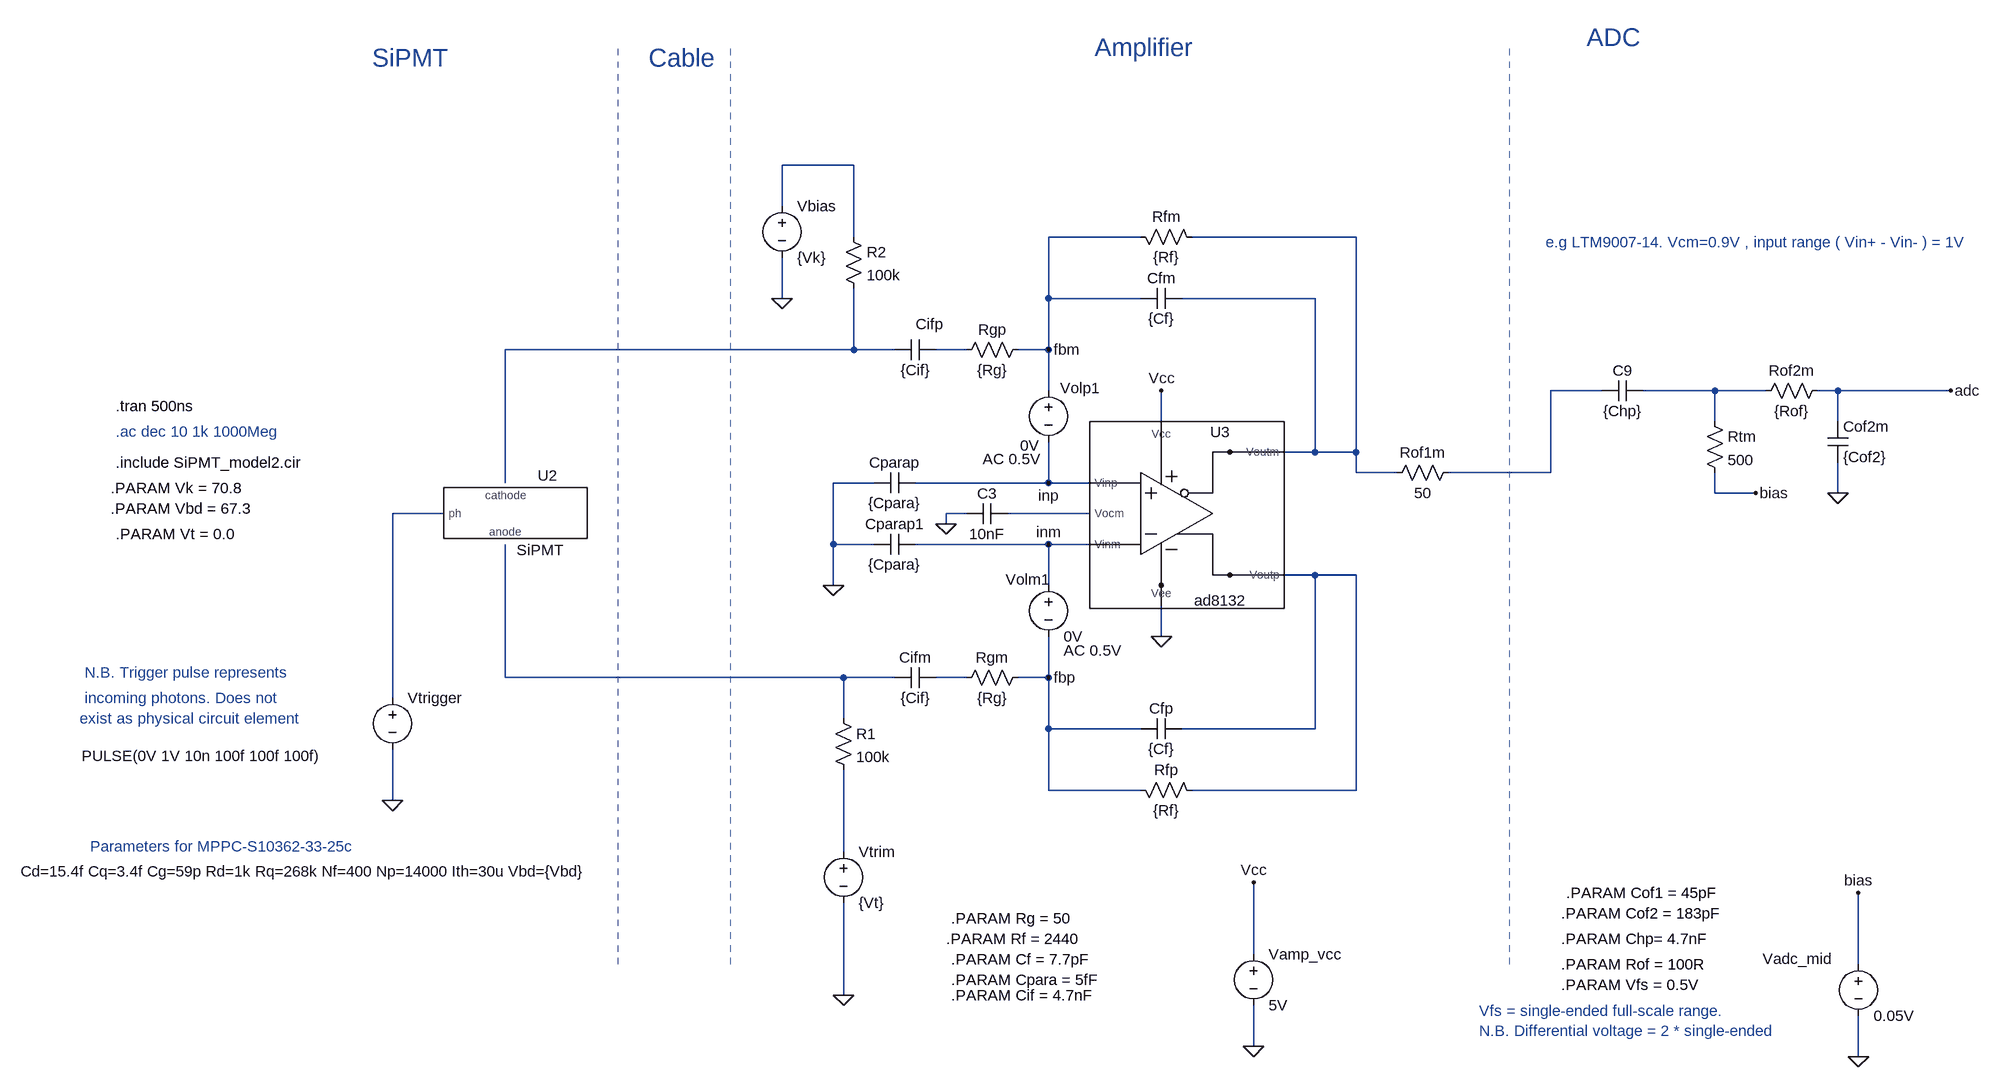
[diagram p0: schematic SiPMT_test_mppc33_ad81322_v8_unipolar_open_loop.asc]
SiPMT_test_mppc33_ad81322_v8_unipolar_open_loop.asc, the LTspice schematic file:
Version 4
SHEET 1 3296 1892
WIRE 1456 64 1344 64
WIRE 1344 128 1344 64
WIRE 1456 176 1456 64
WIRE 1904 176 1760 176
WIRE 2240 176 1984 176
WIRE 1344 272 1344 208
WIRE 1760 272 1760 176
WIRE 1904 272 1760 272
WIRE 2176 272 1968 272
WIRE 1456 352 1456 256
WIRE 1456 352 912 352
WIRE 1520 352 1456 352
WIRE 1632 352 1584 352
WIRE 1760 352 1760 272
WIRE 1760 352 1712 352
WIRE 1760 416 1760 352
WIRE 2624 416 2544 416
WIRE 2800 416 2688 416
WIRE 2880 416 2800 416
WIRE 2992 416 2960 416
WIRE 3168 416 2992 416
WIRE 1936 464 1936 416
WIRE 2800 464 2800 416
WIRE 2992 464 2992 416
WIRE 2176 512 2176 272
WIRE 2176 512 2128 512
WIRE 2240 512 2240 176
WIRE 2240 512 2176 512
WIRE 2240 544 2240 512
WIRE 2304 544 2240 544
WIRE 2544 544 2544 416
WIRE 2544 544 2384 544
WIRE 912 560 912 352
WIRE 1488 560 1424 560
WIRE 1760 560 1760 496
WIRE 1760 560 1552 560
WIRE 1824 560 1760 560
WIRE 2800 576 2800 544
WIRE 2864 576 2800 576
WIRE 2992 576 2992 528
WIRE 816 608 736 608
WIRE 1632 608 1600 608
WIRE 1824 608 1696 608
WIRE 1600 624 1600 608
WIRE 1424 656 1424 560
WIRE 1488 656 1424 656
WIRE 1760 656 1552 656
WIRE 1824 656 1760 656
WIRE 2176 704 2128 704
WIRE 2240 704 2176 704
WIRE 1424 720 1424 656
WIRE 1760 720 1760 656
WIRE 1936 800 1936 752
WIRE 912 864 912 656
WIRE 1440 864 912 864
WIRE 1520 864 1440 864
WIRE 1632 864 1584 864
WIRE 1760 864 1760 800
WIRE 1760 864 1712 864
WIRE 736 896 736 608
WIRE 1440 928 1440 864
WIRE 1760 944 1760 864
WIRE 1904 944 1760 944
WIRE 2176 944 2176 704
WIRE 2176 944 1968 944
WIRE 1760 1040 1760 944
WIRE 1904 1040 1760 1040
WIRE 2240 1040 2240 704
WIRE 2240 1040 1984 1040
WIRE 736 1056 736 976
WIRE 1440 1136 1440 1008
WIRE 2080 1296 2080 1184
WIRE 3024 1312 3024 1200
WIRE 1440 1360 1440 1216
WIRE 2080 1440 2080 1376
WIRE 3024 1456 3024 1392
FLAG 1344 272 0
FLAG 1440 1360 0
FLAG 736 1056 0
FLAG 1936 416 Vcc
FLAG 1936 800 0
FLAG 2080 1440 0
FLAG 2080 1184 Vcc
FLAG 1600 624 0
FLAG 3168 416 adc
FLAG 3024 1456 0
FLAG 3024 1200 bias
FLAG 2864 576 bias
FLAG 2992 576 0
FLAG 1760 352 fbm
FLAG 1760 560 inp
FLAG 1760 656 inm
FLAG 1760 864 fbp
FLAG 1424 720 0
SYMBOL voltage 1344 112 R0
SYMATTR InstName Vbias
SYMATTR Value {Vk}
SYMBOL res 1424 912 R0
SYMATTR InstName R1
SYMATTR Value 100k
SYMBOL voltage 736 880 R0
WINDOW 3 -485 106 Left 2
SYMATTR Value PULSE(0V 1V 10n 100f 100f 100f)
SYMATTR InstName Vtrigger
SYMBOL res 1440 160 R0
SYMATTR InstName R2
SYMATTR Value 100k
SYMBOL cap 1520 336 M90
WINDOW 0 -8 54 VBottom 2
WINDOW 3 32 32 VTop 2
SYMATTR InstName Cifp
SYMATTR Value {Cif}
SYMBOL cap 1520 848 M90
WINDOW 0 0 32 VBottom 2
WINDOW 3 32 32 VTop 2
SYMATTR InstName Cifm
SYMATTR Value {Cif}
SYMBOL res 1728 336 R90
WINDOW 0 0 56 VBottom 2
WINDOW 3 32 56 VTop 2
SYMATTR InstName Rgp
SYMATTR Value {Rg}
SYMBOL res 1728 848 R90
WINDOW 0 0 56 VBottom 2
WINDOW 3 32 56 VTop 2
SYMATTR InstName Rgm
SYMATTR Value {Rg}
SYMBOL voltage 2080 1280 R0
WINDOW 123 0 0 Left 2
WINDOW 39 0 0 Left 2
SYMATTR InstName Vamp_vcc
SYMATTR Value 5V
SYMBOL cap 1696 592 R90
WINDOW 0 0 32 VBottom 2
WINDOW 3 32 32 VTop 2
SYMATTR InstName C3
SYMATTR Value 10nF
SYMBOL res 1888 160 M90
WINDOW 0 0 56 VBottom 2
WINDOW 3 32 56 VTop 2
SYMATTR InstName Rfm
SYMATTR Value {Rf}
SYMBOL cap 1968 256 R90
WINDOW 0 0 32 VBottom 2
WINDOW 3 32 32 VTop 2
SYMATTR InstName Cfm
SYMATTR Value {Cf}
SYMBOL res 1888 1024 M90
WINDOW 0 0 56 VBottom 2
WINDOW 3 32 56 VTop 2
SYMATTR InstName Rfp
SYMATTR Value {Rf}
SYMBOL cap 1968 928 R90
WINDOW 0 0 32 VBottom 2
WINDOW 3 32 32 VTop 2
SYMATTR InstName Cfp
SYMATTR Value {Cf}
SYMBOL cap 2688 400 R90
WINDOW 0 0 32 VBottom 2
WINDOW 3 32 32 VTop 2
SYMATTR InstName C9
SYMATTR Value {Chp}
SYMBOL res 2784 448 R0
SYMATTR InstName Rtm
SYMATTR Value 500
SYMBOL res 2976 400 R90
WINDOW 0 0 56 VBottom 2
WINDOW 3 32 56 VTop 2
SYMATTR InstName Rof2m
SYMATTR Value {Rof}
SYMBOL cap 2976 464 R0
SYMATTR InstName Cof2m
SYMATTR Value {Cof2}
SYMBOL voltage 3024 1296 R0
WINDOW 123 0 0 Left 2
WINDOW 39 0 0 Left 2
WINDOW 0 -149 7 Left 2
SYMATTR InstName Vadc_mid
SYMATTR Value 0.05V
SYMBOL voltage 1440 1120 R0
SYMATTR InstName Vtrim
SYMATTR Value {Vt}
SYMBOL SiPMT 912 608 R0
WINDOW 39 -316 543 Top 2
SYMATTR SpiceLine Cd=15.4f Cq=3.4f Cg=59p Rd=1k Rq=268k Nf=400 Np=14000 Ith=30u Vbd={Vbd}
SYMATTR InstName U2
SYMBOL cap 1552 544 R90
WINDOW 0 0 32 VBottom 2
WINDOW 3 32 32 VTop 2
SYMATTR InstName Cparap
SYMATTR Value {Cpara}
SYMBOL cap 1552 640 R90
WINDOW 0 0 32 VBottom 2
WINDOW 3 32 32 VTop 2
SYMATTR InstName Cparap1
SYMATTR Value {Cpara}
SYMBOL res 2400 528 R90
WINDOW 0 0 56 VBottom 2
WINDOW 3 32 56 VTop 2
SYMATTR InstName Rof1m
SYMATTR Value 50
SYMBOL ad8132 1952 608 R0
SYMATTR InstName U3
SYMBOL voltage 1760 400 R0
WINDOW 0 18 12 Left 2
WINDOW 3 -44 102 Left 2
WINDOW 123 -103 123 Left 2
SYMATTR InstName Volp1
SYMATTR Value 0V
SYMATTR Value2 AC 0.5V
SYMBOL voltage 1760 704 R0
WINDOW 0 -67 7 Left 2
WINDOW 123 24 118 Left 2
SYMATTR InstName Volm1
SYMATTR Value2 AC 0.5V
SYMATTR Value 0V
TEXT 304 480 Left 2 ;.ac dec 10 1k 1000Meg
TEXT 304 528 Left 2 !.include SiPMT_model2.cir
TEXT 296 568 Left 2 !.PARAM Vk = 70.8
TEXT 296 600 Left 2 !.PARAM Vbd = 67.3
TEXT 264 1128 Left 2 ;Parameters for MPPC-S10362-33-25c
TEXT 1608 1240 Left 2 !.PARAM Rg = 50
TEXT 1600 1272 Left 2 !.PARAM Rf = 2440
TEXT 1608 1304 Left 2 !.PARAM Cf = 7.7pF
TEXT 2560 1232 Left 2 !.PARAM Cof2 = 183pF
TEXT 2560 1272 Left 2 !.PARAM Chp= 4.7nF
TEXT 2560 1312 Left 2 !.PARAM Rof = 100R
TEXT 1832 -120 Left 4 ;Amplifier
TEXT 2600 -136 Left 4 ;ADC
TEXT 704 -104 Left 4 ;SiPMT
TEXT 256 856 Left 2 ;N.B. Trigger pulse represents
TEXT 256 896 Left 2 ;incoming photons. Does not
TEXT 248 928 Left 2 ;exist as physical circuit element
TEXT 2536 184 Left 2 ;e.g LTM9007-14. Vcm=0.9V , input range ( Vin+ - Vin- ) = 1V
TEXT 304 640 Left 2 !.PARAM Vt = 0.0
TEXT 1136 -104 Left 4 ;Cable
TEXT 1608 1336 Left 2 !.PARAM Cpara = 5fF
TEXT 304 440 Left 2 !.tran 500ns
TEXT 1608 1360 Left 2 !.PARAM Cif = 4.7nF
TEXT 2560 1344 Left 2 !.PARAM Vfs = 0.5V
TEXT 2432 1384 Left 2 ;Vfs = single-ended full-scale range. \nN.B. Differential voltage = 2 * single-ended
TEXT 2568 1200 Left 2 !.PARAM Cof1 = 45pF
LINE Normal 2480 1312 2480 -128 2
LINE Normal 1264 1312 1264 -128 2
LINE Normal 1088 1312 1088 -128 2

The netlist it stands for:
* SiPMT_test_mppc33_ad81322_v8_unipolar_open_loop.asc
Vbias N001 0 {Vk}
R1 N010 N012 100k
Vtrigger N007 0 PULSE(0V 1V 10n 100f 100f 100f)
R2 N001 N003 100k
Cifp N003 N004 {Cif}
Cifm N010 N011 {Cif}
Rgp fbm N004 {Rg}
Rgm fbp N011 {Rg}
Vamp_vcc Vcc 0 5V
C3 N008 0 10nF
Rfm fbm N002 {Rf}
Cfm N002 fbm {Cf}
Rfp fbp N009 {Rf}
Cfp N009 fbp {Cf}
C9 N006 N005 {Chp}
Rtm N006 bias 500
Rof2m adc N006 {Rof}
Cof2m adc 0 {Cof2}
Vadc_mid bias 0 0.05V
Vtrim N012 0 {Vt}
XU2 N010 N003 N007 SiPMT Cd=15.4f Cq=3.4f Cg=59p Rd=1k Rq=268k Nf=400 Np=14000 Ith=30u Vbd={Vbd}  ; pins anode cathode ph
Cparap inp 0 {Cpara}
Cparap1 inm 0 {Cpara}
Rof1m N005 N002 50
XU3 inp inm Vcc 0 N002 N009 N008 ad8132  ; pins Vinp Vinm Vcc Vee Voutm Voutp Vocm
Volp1 fbm inp 0V AC 0.5V
Volm1 inm fbp 0V AC 0.5V
* .ac dec 10 1k 1000Meg
.include SiPMT_model2.cir
.PARAM Vk = 70.8
.PARAM Vbd = 67.3
* Parameters for MPPC-S10362-33-25c
.PARAM Rg = 50
.PARAM Rf = 2440
.PARAM Cf = 7.7pF
.PARAM Cof2 = 183pF
.PARAM Chp= 4.7nF
.PARAM Rof = 100R
* Amplifier
* ADC
* SiPMT
* N.B. Trigger pulse represents
* incoming photons. Does not
* exist as physical circuit element
* e.g LTM9007-14. Vcm=0.9V , input range ( Vin+ - Vin- ) = 1V
.PARAM Vt = 0.0
* Cable
.PARAM Cpara = 5fF
.tran 500ns
.PARAM Cif = 4.7nF
.PARAM Vfs = 0.5V
* Vfs = single-ended full-scale range.
* N.B. Differential voltage = 2 * single-ended
.PARAM Cof1 = 45pF
.lib SiPMT_model2.cir
.lib ./ad8132.cir
.backanno
.end